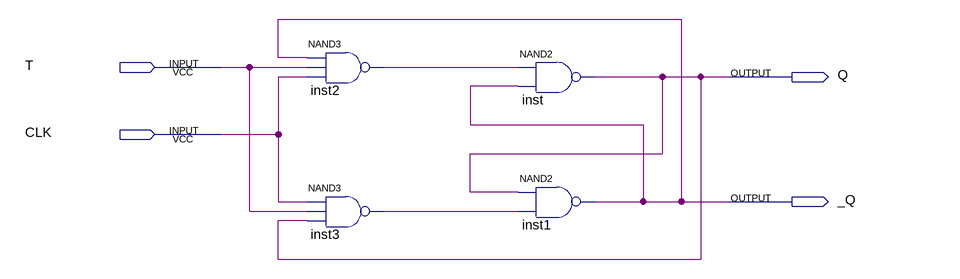
[diagram p0: schematic sheet]
// Quartus schematic fftclk.bdf as structural Verilog: 4 symbols, 4 pins
module fftclk (
  input  T,
  input  CLK,
  output Q,
  output _Q
);

  wire inst2_out, inst3_out;

  nand inst2 (inst2_out, _Q, T, CLK);
  nand inst3 (inst3_out, CLK, T, Q);
  nand inst (Q, inst2_out, _Q);
  nand inst1 (_Q, Q, inst3_out);
endmodule
